# EAGLE design keyboard (EAGLE 7.5.0)
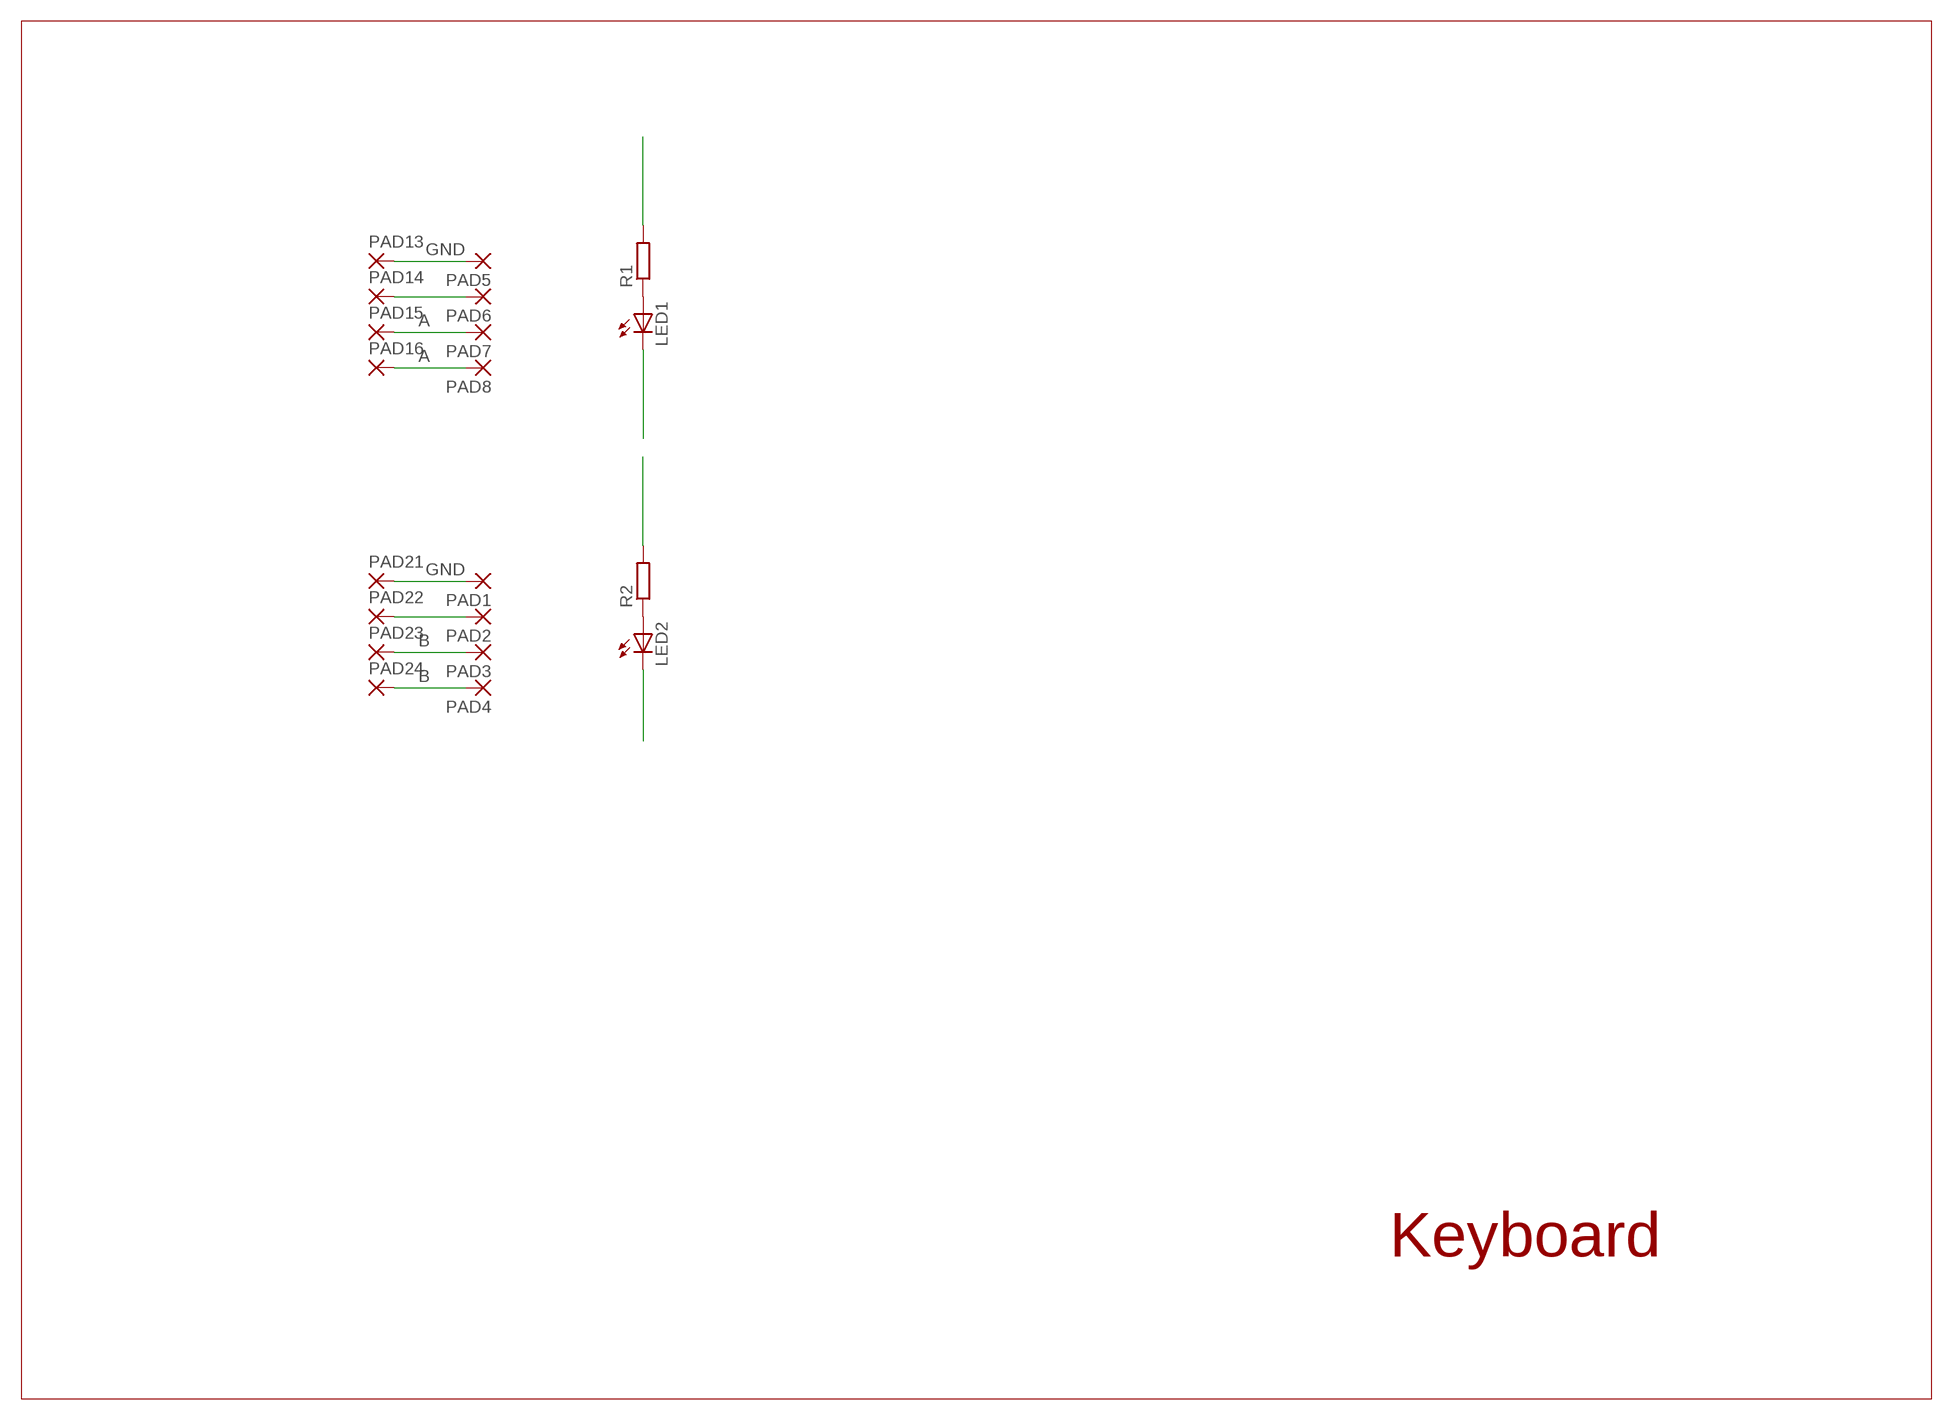
[diagram p0: schematic, sheet 1]

## Parts
LED1  LEDCHIP-LED0805  [CHIP-LED0805]
LED2  LEDCHIP-LED0805  [CHIP-LED0805]
PAD1  WIREPAD1,6/0,8  [1,6/0,8]
PAD2  WIREPAD1,6/0,8  [1,6/0,8]
PAD3  WIREPAD1,6/0,8  [1,6/0,8]
PAD4  WIREPAD1,6/0,8  [1,6/0,8]
PAD5  WIREPAD1,6/0,8  [1,6/0,8]
PAD6  WIREPAD1,6/0,8  [1,6/0,8]
PAD7  WIREPAD1,6/0,8  [1,6/0,8]
PAD8  WIREPAD1,6/0,8  [1,6/0,8]
PAD13  WIREPAD1,6/0,8  [1,6/0,8]
PAD14  WIREPAD1,6/0,8  [1,6/0,8]
PAD15  WIREPAD1,6/0,8  [1,6/0,8]
PAD16  WIREPAD1,6/0,8  [1,6/0,8]
PAD21  WIREPAD1,6/0,8  [1,6/0,8]
PAD22  WIREPAD1,6/0,8  [1,6/0,8]
PAD23  WIREPAD1,6/0,8  [1,6/0,8]
PAD24  WIREPAD1,6/0,8  [1,6/0,8]
R1  R-EU_R0805  [R0805]
R2  R-EU_R0805  [R0805]

## Nets
A: PAD7.1(P) PAD8.1(P) PAD15.1(P) PAD16.1(P) R1.2
B: PAD3.1(P) PAD4.1(P) PAD23.1(P) PAD24.1(P) R2.2
GND: LED1.C LED2.C PAD1.1(P) PAD2.1(P) PAD5.1(P) PAD6.1(P) PAD13.1(P) PAD14.1(P) PAD21.1(P) PAD22.1(P)
N$1: LED1.A R1.1
N$2: LED2.A R2.1

## Notes on the sheet
- Keyboard

## Library data of the parts
LED1 LED2 = led:LED: LED OSRAM: - CHIPLED LG R971, LG N971, LY N971, LG Q971, LY Q971, LO R971, LY R971 LH N974, LH R974 LS Q976, LO Q976, LY Q976 LO Q996 - Hyper CHIPLED LW Q18S LB Q993, LB Q99A, LB R99A - SideLED LS A670, LO A670, LY A670, LG A670, LP A670 LB A673, LV A673, LT A673, LW A673 LH A674 LY A675 LS A676, LA A676, LO A676, LY A676, LW A676 LS A679, LY A679, LG A679 - Hyper Micro SIDELED® LS Y876, LA Y876, LO Y876, LY Y876 LT Y87S - SmartLED LW L88C, LW L88S LB L89C, LB L89S, LG L890 LS L89K, LO L89K, LY L89K LS L896, LA L896, LO L896, LY L896 - TOPLED LS T670, LO T670, LY T670, LG T670, LP T670 LSG T670, LSP T670, LSY T670, LOP T670, LYG T670 LG T671, LOG T671, LSG T671 LB T673, LV T673, LT T673, LW T673 LH T674 LS T676, LA T676, LO T676, LY T676, LB T676, LH T676, LSB T676, LW T676 LB T67C, LV T67C, LT T67C, LS T67K, LO T67K, LY T67K, LW E67C LS E67B, LA E67B, LO E67B, LY E67B, LB E67C, LV E67C, LT E67C LW T67C LS T679, LY T679, LG T679 LS T770, LO T770, LY T770, LG T770, LP T770 LB T773, LV T773, LT T773, LW T773 LH T774 LS E675, LA E675, LY E675, LS T675 LS T776, LA T776, LO T776, LY T776, LB T776 LHGB T686 LT T68C, LB T68C - Hyper Mini TOPLED® LB M676 - Mini TOPLED Santana® LG M470 LS M47K, LO M47K, LY M47K Source: http://www.osram.convergy.de LUXEON: - LUMILED® LXK2-PW12-R00, LXK2-PW12-S00, LXK2-PW14-U00, LXK2-PW14-V00 LXK2-PM12-R00, LXK2-PM12-S00, LXK2-PM14-U00 LXK2-PE12-Q00, LXK2-PE12-R00, LXK2-PE12-S00, LXK2-PE14-T00, LXK2-PE14-U00 LXK2-PB12-K00, LXK2-PB12-L00, LXK2-PB12-M00, LXK2-PB14-N00, LXK2-PB14-P00, LXK2-PB14-Q00 LXK2-PR12-L00, LXK2-PR12-M00, LXK2-PR14-Q00, LXK2-PR14-R00 LXK2-PD12-Q00, LXK2-PD12-R00, LXK2-PD12-S00 LXK2-PH12-R00, LXK2-PH12-S00 LXK2-PL12-P00, LXK2-PL12-Q00, LXK2-PL12-R00 Source: www.luxeon.com KINGBRIGHT: KA-3528ASYC Source: www.kingbright.com
PAD1-PAD8 PAD13-PAD16 PAD21-PAD24 = wirepad:WIREPAD: Wire PAD connect wire on PCB
R1 R2 = rcl:R-EU_: RESISTOR, European symbol

## Board
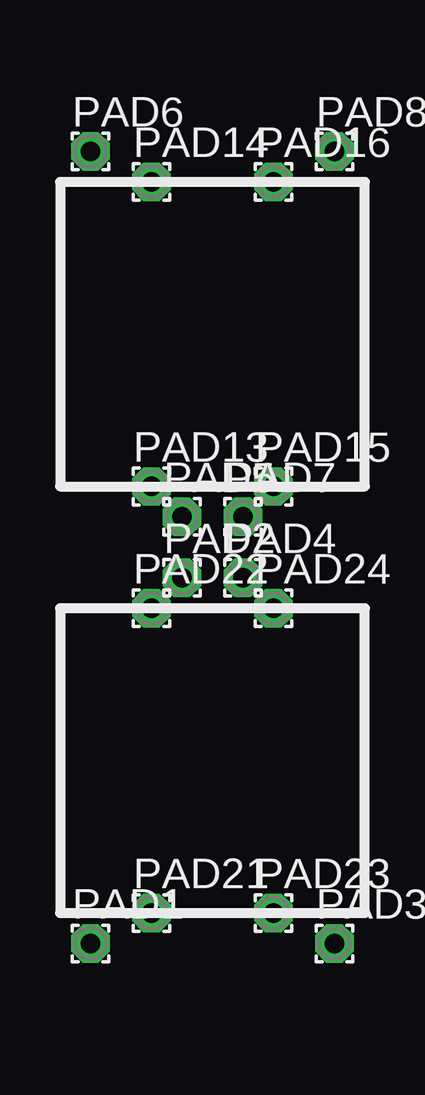
[diagram p1: board, top side]
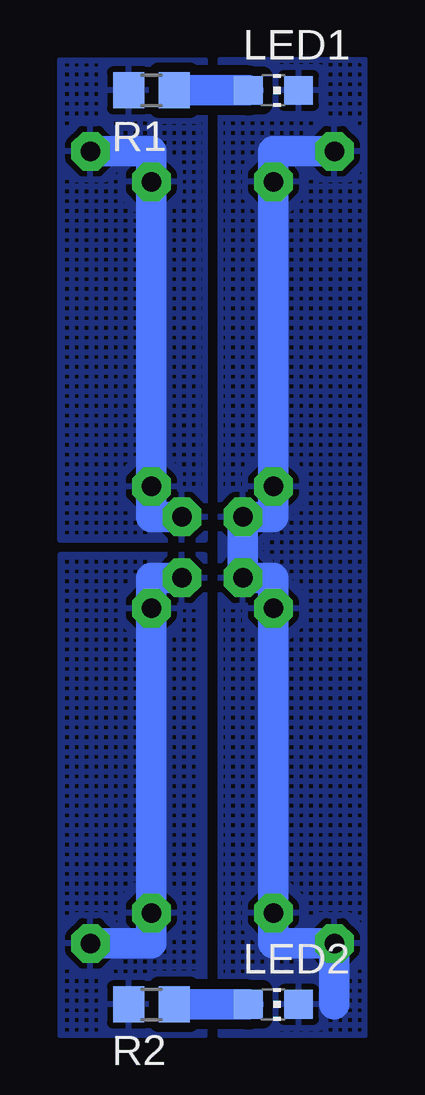
[diagram p2: board, bottom side, seen from below]

No outline drawn. Coordinates in mm, seen from the top.
Copper layers (1*16): Top 0.035mm / dielectric 1.5mm / Bottom 0.035mm
Design rules "default": minimum track width 10mil, minimum drill 24mil, track to track 8mil, track to pad 8mil, pad to pad 8mil, via to via 8mil, smd to smd 8mil, copper to edge 40mil, drill to drill 8mil, minimum pad ring 10mil, minimum via ring 8mil, stop-mask expansion 4mil, vias tented up to drill 0mil, thermal gap 10mil

### Footprints (pad centres in the part's own frame; a part is rotated, then mirrored left to right if it is on the bottom)
CHIP-LED0805 = smd 1.2 x 1.2: A 0,-1.05; C 0,1.05
1,6/0,8 = drill 0.813 pad 1.6 octagon: 1 0,0
R0805 = smd 1.3 x 1.5: 1 -0.95,0; 2 0.95,0

### Placement (x,y rotation side)
LED1  3.81,39.37 270 bottom
LED2  3.81,1.27 270 bottom
PAD1  1.27,3.81 0 top
PAD2  5.08,19.05 0 top
PAD3  11.43,3.81 0 top
PAD4  7.62,19.05 0 top
PAD5  5.08,21.59 0 top
PAD6  1.27,36.83 0 top
PAD7  7.62,21.59 0 top
PAD8  11.43,36.83 0 top
PAD13  3.81,22.86 0 top
PAD14  3.81,35.56 0 top
PAD15  8.89,22.86 0 top
PAD16  8.89,35.56 0 top
PAD21  3.81,5.08 0 top
PAD22  3.81,17.78 0 top
PAD23  8.89,5.08 0 top
PAD24  8.89,17.78 0 top
R1  8.89,39.37 180 bottom
R2  8.89,1.27 180 bottom

### Tracks (layer width: path | path; a pad name or v marks a point on that pad's centre or on a via)
A
  Bottom 1.27: PAD8.1 8.89,36.83 PAD16.1 PAD15.1 8.89,21.59 PAD7.1
  pour Bottom (isolate 0.406, hatched): 12.7,40.64 6.67,40.64 6.67,20.64 12.7,20.64
B
  Bottom 1.27: PAD3.1 8.89,3.81 PAD23.1 PAD24.1 8.89,19.05 PAD4.1
  pour Bottom (isolate 0.406, hatched): 12.7,0 6.67,0 6.67,20 12.7,20
GND
  Bottom 1.27: PAD6.1 3.81,36.83 PAD14.1 PAD13.1 3.81,21.59 PAD5.1 PAD2.1 3.81,19.05 PAD22.1 PAD21.1 3.81,3.81 PAD1.1 1.27,1.27
  pour Bottom (isolate 0.406, hatched): 0,40.64 6.03,40.64 6.03,0 0,0
N$1
  Bottom 1.27: LED1.A R1.1
N$2
  Bottom 1.27: LED2.A R2.1